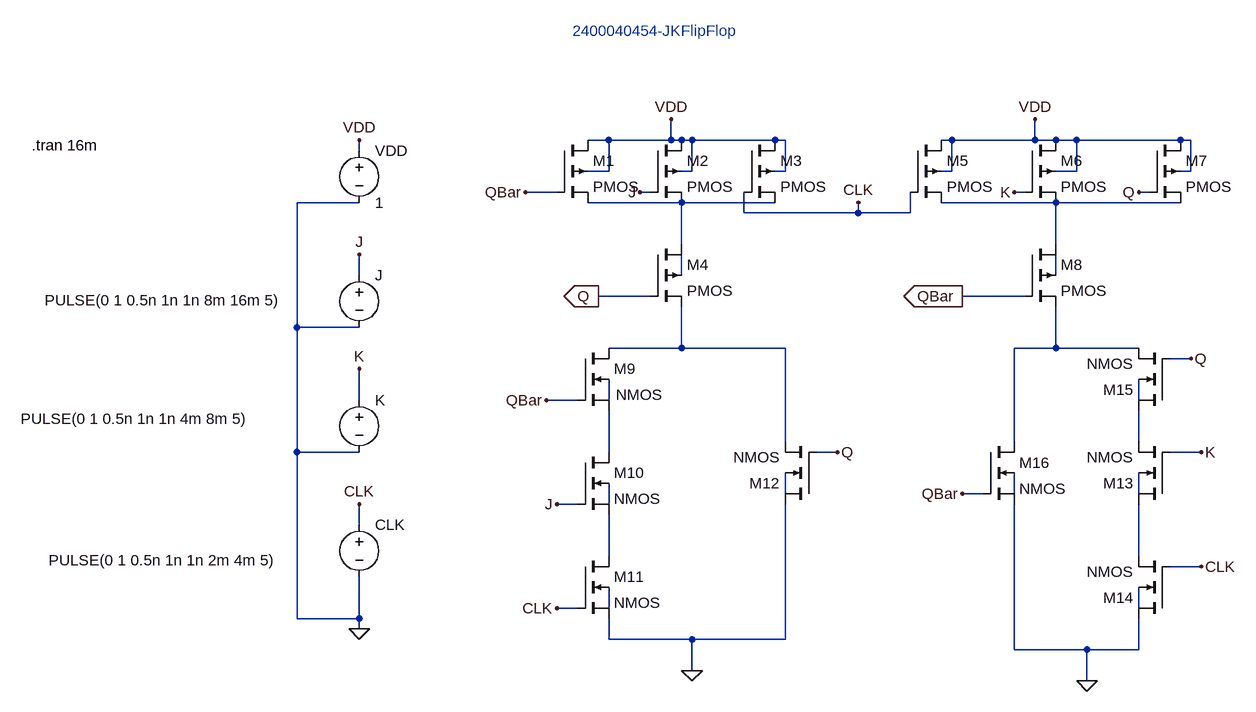
[diagram p0: schematic JKFlipFlop.asc]
JKFlipFlop.asc, the LTspice schematic file:
Version 4.1
SHEET 1 944 868
WIRE -32 16 -64 16
WIRE 64 16 64 -16
WIRE 64 16 -32 16
WIRE 80 16 64 16
WIRE 96 16 80 16
WIRE 224 16 96 16
WIRE 240 16 224 16
WIRE 496 16 480 16
WIRE 624 16 624 -16
WIRE 624 16 496 16
WIRE 656 16 624 16
WIRE 688 16 656 16
WIRE 848 16 688 16
WIRE 864 16 848 16
WIRE -416 32 -416 16
WIRE -32 64 -32 16
WIRE -32 64 -64 64
WIRE 96 64 96 16
WIRE 96 64 80 64
WIRE 240 64 240 16
WIRE 240 64 224 64
WIRE 496 64 496 16
WIRE 496 64 480 64
WIRE 688 64 688 16
WIRE 688 64 656 64
WIRE 864 64 864 16
WIRE 864 64 848 64
WIRE -112 96 -160 96
WIRE 32 96 16 96
WIRE 608 96 592 96
WIRE 800 96 784 96
WIRE -416 112 -512 112
WIRE 80 112 -64 112
WIRE 224 112 80 112
WIRE 656 112 656 96
WIRE 656 112 480 112
WIRE 848 112 656 112
WIRE 176 128 176 96
WIRE 352 128 352 112
WIRE 352 128 176 128
WIRE 432 128 432 96
WIRE 432 128 352 128
WIRE 80 176 80 112
WIRE 656 176 656 112
WIRE -416 224 -416 192
WIRE 80 224 80 192
WIRE 656 224 656 192
WIRE 32 256 -48 256
WIRE 608 256 512 256
WIRE -512 304 -512 112
WIRE -416 304 -512 304
WIRE 80 336 80 272
WIRE 80 336 -32 336
WIRE 240 336 80 336
WIRE 656 336 656 272
WIRE 656 336 592 336
WIRE 784 336 656 336
WIRE 864 352 832 352
WIRE -416 416 -416 368
WIRE -80 416 -128 416
WIRE -32 416 -32 384
WIRE 784 416 784 384
WIRE 240 480 240 336
WIRE 592 480 592 336
WIRE 784 480 784 432
WIRE -512 496 -512 304
WIRE -416 496 -512 496
WIRE -32 496 -32 432
WIRE 320 496 288 496
WIRE 880 496 832 496
WIRE 240 560 240 528
WIRE 544 560 512 560
WIRE 592 560 592 528
WIRE 784 560 784 528
WIRE -80 576 -112 576
WIRE -32 576 -32 544
WIRE -416 608 -416 576
WIRE -32 656 -32 592
WIRE 784 656 784 576
WIRE 880 672 832 672
WIRE -80 736 -112 736
WIRE -32 736 -32 704
WIRE 784 736 784 704
WIRE -512 752 -512 496
WIRE -416 752 -416 688
WIRE -416 752 -512 752
WIRE -416 768 -416 752
WIRE -32 784 -32 752
WIRE 96 784 -32 784
WIRE 240 784 240 576
WIRE 240 784 96 784
WIRE 592 800 592 576
WIRE 704 800 592 800
WIRE 784 800 784 752
WIRE 784 800 704 800
WIRE 96 832 96 784
WIRE 704 848 704 800
FLAG 96 832 0
FLAG 704 848 0
FLAG 512 256 QBar
IOPIN 512 256 Out
FLAG -160 96 QBar
FLAG 16 96 J
FLAG 592 96 K
FLAG 784 96 Q
FLAG 512 560 QBar
FLAG 320 496 Q
FLAG 864 352 Q
FLAG 880 496 K
FLAG 880 672 CLK
FLAG -112 736 CLK
FLAG -112 576 J
FLAG -128 416 QBar
FLAG -416 768 0
FLAG -416 16 VDD
FLAG 64 -16 VDD
FLAG 624 -16 VDD
FLAG -416 192 J
FLAG -416 368 K
FLAG -416 576 CLK
FLAG 352 112 CLK
FLAG -48 256 Q
IOPIN -48 256 Out
SYMBOL pmos4 -112 16 R0
SYMATTR InstName M1
SYMBOL pmos4 32 16 R0
SYMATTR InstName M2
SYMBOL pmos4 176 16 R0
SYMATTR InstName M3
SYMBOL pmos4 432 16 R0
SYMATTR InstName M5
SYMBOL pmos4 608 16 R0
SYMATTR InstName M6
SYMBOL pmos4 800 16 R0
SYMATTR InstName M7
SYMBOL pmos4 608 176 R0
SYMATTR InstName M8
SYMBOL nmos4 -80 336 R0
WINDOW 3 59 72 Left 2
SYMATTR InstName M9
SYMBOL nmos4 -80 496 R0
SYMATTR InstName M10
SYMBOL nmos4 -80 656 R0
SYMATTR InstName M11
SYMBOL nmos4 288 576 R180
SYMATTR InstName M12
SYMBOL nmos4 832 576 R180
SYMATTR InstName M13
SYMBOL nmos4 832 752 R180
SYMATTR InstName M14
SYMBOL nmos4 832 432 R180
SYMATTR InstName M15
SYMBOL nmos4 544 480 R0
SYMATTR InstName M16
SYMBOL voltage -416 16 R0
WINDOW 123 0 0 Left 0
WINDOW 39 0 0 Left 0
SYMATTR InstName VDD
SYMATTR Value 1
SYMBOL voltage -416 208 R0
WINDOW 3 -484 54 Left 2
WINDOW 123 0 0 Left 0
WINDOW 39 0 0 Left 0
SYMATTR Value PULSE(0 1 0.5n 1n 1n 8m 16m 5)
SYMATTR InstName J
SYMBOL voltage -416 400 R0
WINDOW 3 -521 45 Left 2
WINDOW 123 0 0 Left 0
WINDOW 39 0 0 Left 0
SYMATTR Value PULSE(0 1 0.5n 1n 1n 4m 8m 5)
SYMATTR InstName K
SYMBOL voltage -416 592 R0
WINDOW 3 -478 70 Left 2
WINDOW 123 0 0 Left 0
WINDOW 39 0 0 Left 0
SYMATTR Value PULSE(0 1 0.5n 1n 1n 2m 4m 5)
SYMATTR InstName CLK
SYMBOL pmos4 32 176 R0
SYMATTR InstName M4
TEXT -920 24 Left 2 !.tran 16m
TEXT -88 -152 Left 2 ;2400040454-JKFlipFlop

The netlist it stands for:
* JKFlipFlop.asc
M1 VDD QBar N001 VDD PMOS
M2 VDD J N001 VDD PMOS
M3 VDD CLK N001 VDD PMOS
M5 VDD CLK N002 VDD PMOS
M6 VDD K N002 VDD PMOS
M7 VDD Q N002 VDD PMOS
M8 N002 QBar N006 N004 PMOS
M9 N005 QBar N010 N007 NMOS
M10 N010 J N015 N014 NMOS
M11 N015 CLK 0 N017 NMOS
M12 0 Q N005 N011 NMOS
M13 N016 K N009 N013 NMOS
M14 0 CLK N016 N018 NMOS
M15 N009 Q N006 N008 NMOS
M16 N006 QBar 0 N012 NMOS
VDD VDD 0 1
V§J J 0 PULSE(0 1 0.5n 1n 1n 8m 16m 5)
V§K K 0 PULSE(0 1 0.5n 1n 1n 4m 8m 5)
V§CLK CLK 0 PULSE(0 1 0.5n 1n 1n 2m 4m 5)
M4 N001 Q N005 N003 PMOS
.model NMOS NMOS
.model PMOS PMOS
.lib standard.mos
.tran 16m
* 2400040454-JKFlipFlop
.backanno
.end